# EAGLE design LEDATTACK (EAGLE 9.1.0)
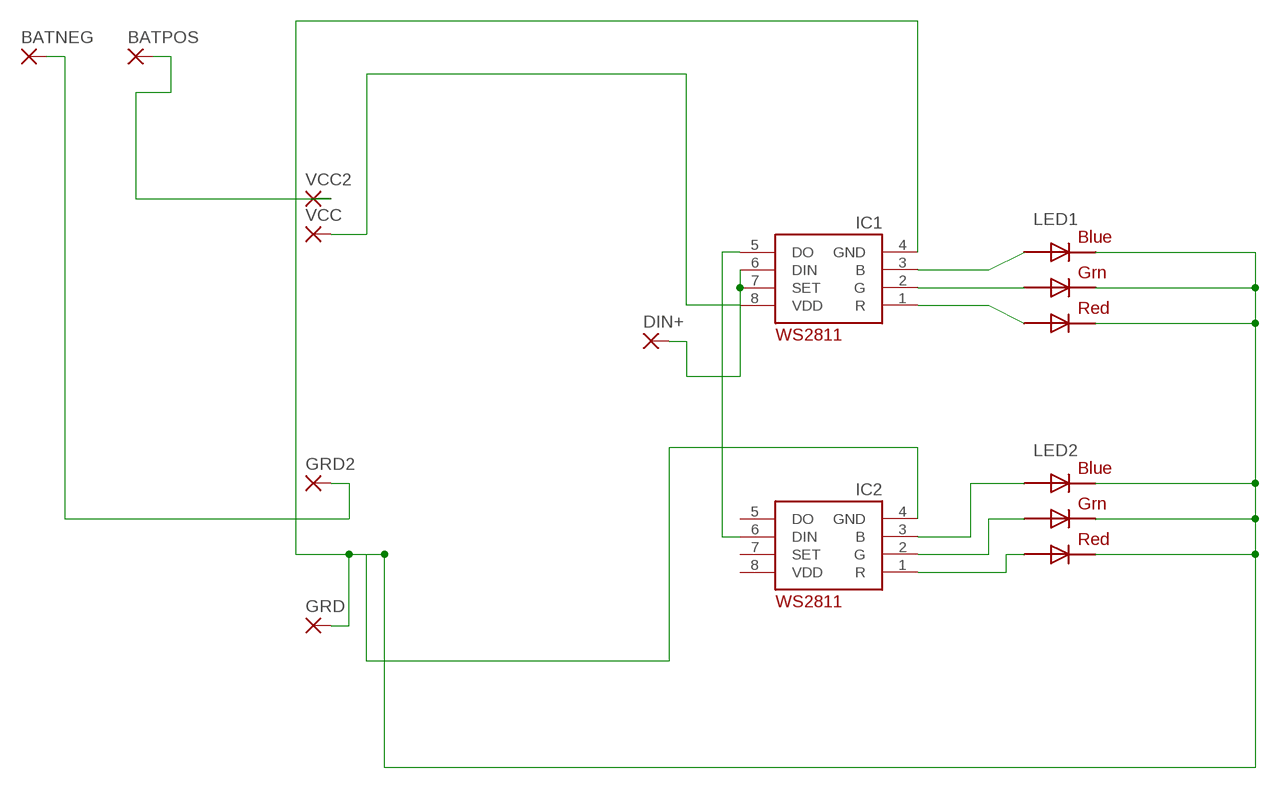
[diagram p0: schematic, sheet 1]

## Parts
BATNEG  1,6/0,8  [1,6/0,8]
BATPOS  1,6/0,8  [1,6/0,8]
DIN+  1,6/0,8  [1,6/0,8]
GRD  1,6/0,8  [1,6/0,8]
GRD2  1,6/0,8  [1,6/0,8]
IC1  WS2811-SOP8  [SO08-SKINNYPADS]
IC2  WS2811-SOP8  [SO08-SKINNYPADS]
LED1  RGBLED5050  [RGBLED5050]
LED2  RGBLED5050  [RGBLED5050]
VCC  1,6/0,8  [1,6/0,8]
VCC2  1,6/0,8  [1,6/0,8]

## Nets
N$1: IC1.3(B) LED1.3(BLUE_A)
N$2: IC1.2(G) LED1.1(GREEN_A)
N$3: IC1.1(R) LED1.2(RED_A)
N$4: GRD.1(P) IC1.4(GND) IC2.4(GND) LED1.4(BLUE_C) LED1.5(RED_C) LED1.6(GREEN_C) LED2.4(BLUE_C) LED2.5(RED_C) LED2.6(GREEN_C)
N$5: IC1.8(VDD) VCC.1(P)
N$6: DIN+.1(P) IC1.6(DIN) IC1.7(SET)
N$7: IC1.5(DO) IC2.6(DIN)
N$9: IC2.1(R) LED2.2(RED_A)
N$10: IC2.2(G) LED2.1(GREEN_A)
N$11: IC2.3(B) LED2.3(BLUE_A)
N$12: BATPOS.1(P) VCC2.1(P)
N$13: BATNEG.1(P) GRD2.1(P)
Unconnected: IC2.5(DO) IC2.7(SET)

## Power pins joined to a net without a drawn wire
VDD: IC2.8(VDD)

## Library data of the parts
BATNEG BATPOS DIN+ GRD GRD2 VCC VCC2 = wirepad:1,6/0,8: THROUGH-HOLE PAD
IC1 IC2 = adafruit:WS2811
LED1 LED2 = adafruit:RGBLED: For 5050 RGB LEDs, the order of the LEDs may vary from one manufacturer to another!

## Board
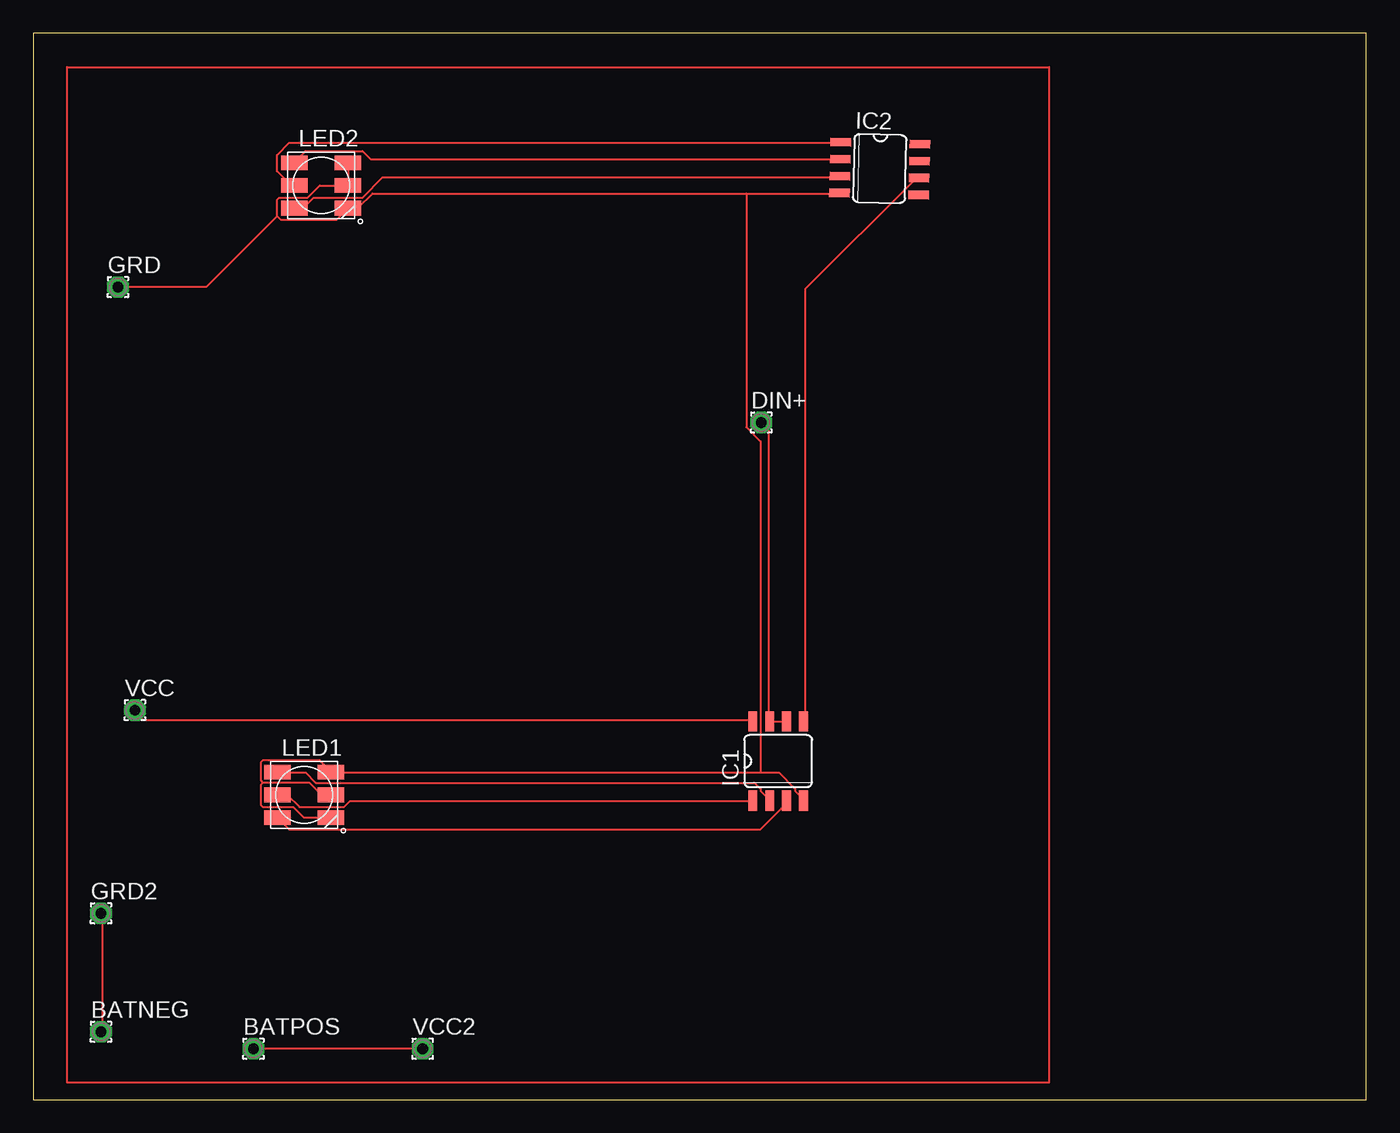
[diagram p1: board, top side]

Size 100 x 80 mm. Coordinates in mm from the lower left corner, seen from the top.
Outline: 0,0 100,0 100,80 0,80 0,0
Copper layers (1*16): Top 0.035mm / dielectric 1.5mm / Bottom 0.035mm
Design rules "default": minimum track width 6mil, minimum drill 0.35mm, track to track 6mil, track to pad 6mil, pad to pad 6mil, via to via 6mil, smd to smd 6mil, copper to edge 40mil, drill to drill 6mil, minimum pad ring 10mil, minimum via ring 8mil, stop-mask expansion 4mil, vias tented up to drill 0mil, thermal gap 10mil

### Footprints (pad centres in the part's own frame; a part is rotated, then mirrored left to right if it is on the bottom)
1,6/0,8 = drill 0.813 pad 1.6 octagon: 1 0,0
SO08-SKINNYPADS = smd 0.66 x 1.524: 1 -1.905,-2.973; 2 -0.635,-2.973; 3 0.635,-2.973; 4 1.905,-2.973; 5 1.905,2.973; 6 0.635,2.973; 7 -0.635,2.973; 8 -1.905,2.973
RGBLED5050 = smd 2 x 1.1: 1 -2,1.7; 2 -2,0; 3 -2,-1.7; 4 2,-1.7; 5 2,0; 6 2,1.7

### Placement (x,y rotation side)
BATNEG  5.08,5.08 0 top
BATPOS  16.51,3.81 0 top
DIN+  54.61,50.8 0 top
GRD  6.35,60.96 0 top
GRD2  5.08,13.97 0 top
IC1  55.88,25.4 0 top
IC2  63.5,69.85 268.6 top
LED1  20.32,22.86 0 top
LED2  21.59,68.58 0 top
VCC  7.62,29.21 0 top
VCC2  29.21,3.81 0 top

### Tracks (layer width: path | path; a pad name or v marks a point on that pad's centre or on a via)
N$1
  Top 0.152: IC1.3 56.39,22.4 56.39,22.1 54.56,20.27 19.2,20.27 18.44,21.03 LED1.3
N$2
  Top 0.152: IC1.2 55.17,22.55 54.56,23.16 54.56,23.32 54.1,23.77 21.18,23.77 20.42,24.54 18.44,24.54 LED1.1
N$3
  Top 0.152: LED1.2 19.05,22.86 19.96,21.95 23.32,21.95 23.77,22.4 53.95,22.4 IC1.1
N$4
  Top 0.152: 17.22,23.77 17.07,23.62 17.07,22.1 17.22,21.95 19.51,21.95 20.27,21.18 22.25,21.18 LED1.4 | 17.22,23.77 20.73,23.77 21.64,22.86 LED1.5 | 54.56,24.54 22.4,24.54 LED1.6 22.25,24.69 21.49,25.45 17.22,25.45 17.07,25.3 17.07,23.93 17.22,23.77 | 54.56,24.54 55.93,24.54 57.15,23.32 57.15,23.16 57.76,22.55 IC1.4 | LED2.6 23.62,70.26 23.62,68.58 LED2.5 21.49,68.58 20.57,67.67 18.44,67.67 18.29,67.51 18.29,66.29 | 53.49,67.97 25.45,67.97 24.38,66.9 23.62,66.9 LED2.4 23.47,66.75 22.71,65.99 18.59,65.99 18.29,66.29 | 53.49,67.97 60.35,67.97 IC2.4 | GRD.1 12.95,60.96 18.29,66.29 | 54.56,24.54 54.56,49.38 53.49,50.44 53.49,67.97
N$5
  Top 0.152: IC1.8 53.95,28.5 8.23,28.5 7.62,29.11 VCC.1
N$6
  Top 0.152: IC1.6 56.39,28.35 55.32,28.35 IC1.7 55.17,28.5 55.17,50.29 54.71,50.75 DIN+.1
N$7
  Top 0.152: IC1.5 57.91,28.5 57.91,60.81 66.14,69.04 66.45,69.04 IC2.6
N$8
  Top 0.152: 2.54,77.47 76.2,77.47 76.2,1.27 2.54,1.27 2.54,77.47
N$9
  Top 0.152: LED2.2 19.36,68.58 18.29,69.65 18.29,70.87 19.2,71.78 60.5,71.78 IC2.1
N$10
  Top 0.152: IC2.2 60.5,70.56 25.3,70.56 24.69,71.17 20.42,71.17 19.66,70.41 LED2.1
N$11
  Top 0.152: IC2.3 60.5,69.19 26.21,69.19 24.69,67.67 21.03,67.67 20.27,66.9 19.66,66.9 LED2.3
N$12
  Top 0.152: VCC2.1 BATPOS.1
N$13
  Top 0.152: BATNEG.1 5.18,5.18 5.18,13.87 GRD2.1